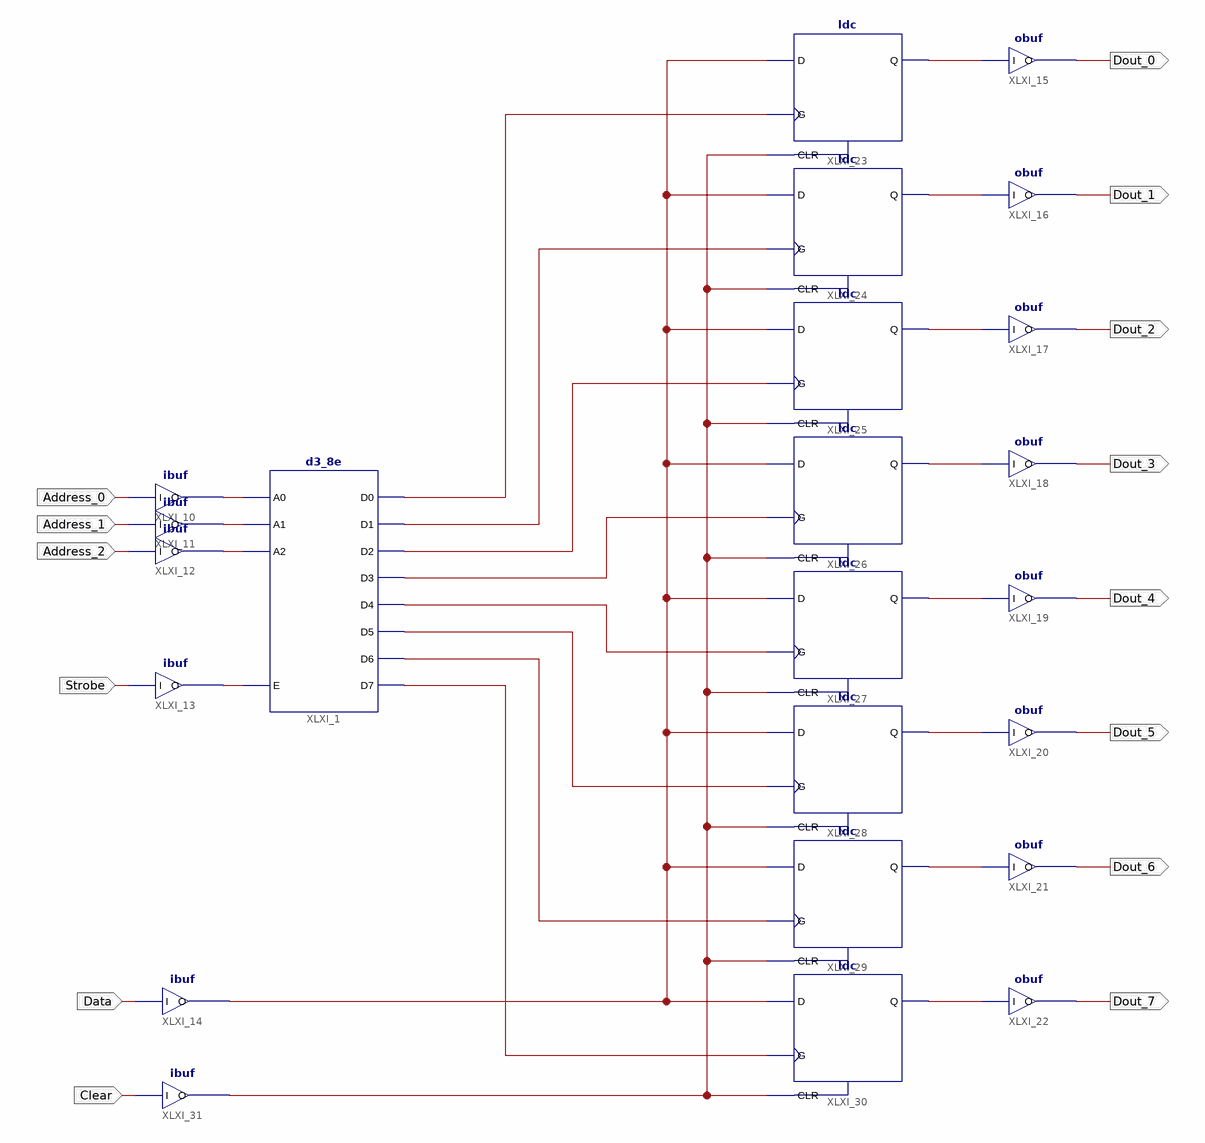
[diagram p0: schematic sheet 1]
// Xilinx ISE schematic Addressable_Latch.sch (xc9500xl) as structural Verilog: 23 symbols, 14 ports
module Addressable_Latch (
  input  Address_0,
  input  Address_1,
  input  Address_2,
  input  Strobe,
  input  Data,
  input  Clear,
  output Dout_7,
  output Dout_6,
  output Dout_5,
  output Dout_4,
  output Dout_3,
  output Dout_2,
  output Dout_1,
  output Dout_0
);

  wire XLXN_1, XLXN_2, XLXN_3, XLXN_4, XLXN_5, XLXN_6, XLXN_7, XLXN_8, XLXN_12, XLXN_13, XLXN_14, XLXN_15,
       XLXN_16, XLXN_26, XLXN_31, XLXN_33, XLXN_34, XLXN_35, XLXN_36, XLXN_37, XLXN_38, XLXN_39;

  d3_8e XLXI_1 (
    .A0(XLXN_12), .A1(XLXN_13), .A2(XLXN_14), .E(XLXN_15), .D0(XLXN_1), .D1(XLXN_2), .D2(XLXN_3),
    .D3(XLXN_4), .D4(XLXN_5), .D5(XLXN_6), .D6(XLXN_7), .D7(XLXN_8));
  ibuf XLXI_10 (.I(Address_0), .O(XLXN_12));
  ibuf XLXI_11 (.I(Address_1), .O(XLXN_13));
  ibuf XLXI_12 (.I(Address_2), .O(XLXN_14));
  ibuf XLXI_13 (.I(Strobe), .O(XLXN_15));
  ibuf XLXI_14 (.I(Data), .O(XLXN_16));
  ldc XLXI_23 (.G(XLXN_1), .CLR(XLXN_31), .D(XLXN_16), .Q(XLXN_39));
  ldc XLXI_24 (.G(XLXN_2), .CLR(XLXN_31), .D(XLXN_16), .Q(XLXN_38));
  ldc XLXI_25 (.G(XLXN_3), .CLR(XLXN_31), .D(XLXN_16), .Q(XLXN_37));
  ldc XLXI_26 (.G(XLXN_4), .CLR(XLXN_31), .D(XLXN_16), .Q(XLXN_26));
  ldc XLXI_27 (.G(XLXN_5), .CLR(XLXN_31), .D(XLXN_16), .Q(XLXN_36));
  ldc XLXI_28 (.G(XLXN_6), .CLR(XLXN_31), .D(XLXN_16), .Q(XLXN_35));
  ldc XLXI_29 (.G(XLXN_7), .CLR(XLXN_31), .D(XLXN_16), .Q(XLXN_34));
  ldc XLXI_30 (.G(XLXN_8), .CLR(XLXN_31), .D(XLXN_16), .Q(XLXN_33));
  obuf XLXI_15 (.I(XLXN_39), .O(Dout_0));
  obuf XLXI_16 (.I(XLXN_38), .O(Dout_1));
  obuf XLXI_17 (.I(XLXN_37), .O(Dout_2));
  obuf XLXI_18 (.I(XLXN_26), .O(Dout_3));
  obuf XLXI_19 (.I(XLXN_36), .O(Dout_4));
  obuf XLXI_20 (.I(XLXN_35), .O(Dout_5));
  obuf XLXI_21 (.I(XLXN_34), .O(Dout_6));
  obuf XLXI_22 (.I(XLXN_33), .O(Dout_7));
  ibuf XLXI_31 (.I(Clear), .O(XLXN_31));
endmodule
